# Altium schematic sheet BME688.SchDoc
size A4; SheetNumber: 3; SheetTotal: 6
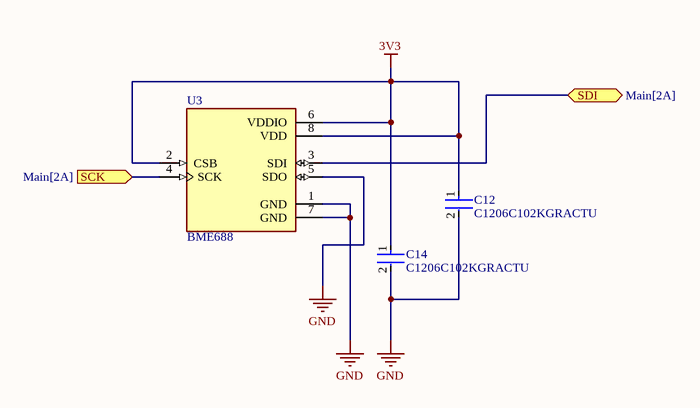
[diagram p0: BME688.SchDoc]

## Parts
C12  C1206C102KGRACTU  [FP-C1206C-EF-IPC_A]
C14  C1206C102KGRACTU  [FP-C1206C-EF-IPC_A]
U3  BME688  [BME680]

## Ports
SCK (in, see Main[2A]), SDI (bidir, see Main[2A])

## Nets
3V3: C12.1 C14.1 U3.2(CSB) U3.6(VDDIO) U3.8(VDD)
GND: C12.2 C14.2 U3.1(GND) U3.5(SDO) U3.7(GND)
SCK: U3.4(SCK) ; port SCK
SDI: U3.3(SDI) ; port SDI

## Library data of the parts
C12 C14 = CMP-03020-034681-1: CAP CER 1000PF 2KV X7R 1206; Tolerance: 10%; Capacitance: 1nF; Dissipation Factor: 2.5%; Dielectric Material: Ceramic; Voltage Rating (DC): 2.5kV; Voltage: 2kV; REACH SVHC: No SVHC; Height: 1.6mm; Construction: Flat; Case/Package: 1206; Series: C; Mount: Surface Mount; RoHS Compliant: Yes; Package Quantity: 1; Length: 3.2mm; Width: 0.063inch; Voltage Rating: 2kV; Min Operating Temperature: -55°C; Case Code (Metric): 3216; Termination: SMD/SMT; Number of Pins: 2; Case Code (Imperial): 1206; Packaging: Tape and Reel; Dielectric: X7R; Thickness: 0.069inch; Depth: 1.6mm; Radiation Hardening: No; Max Operating Temperature: 125°C
U3 = BME688: Gas sensor measuring relative humidity, barometric pressure, ambient temperature and gas (VOC); Package: None; MP: BME688; Price: None; Availability: Unavailable; Value: *